# Altium schematic sheet TopLevel.SchDoc
size A; SheetNumber: 1
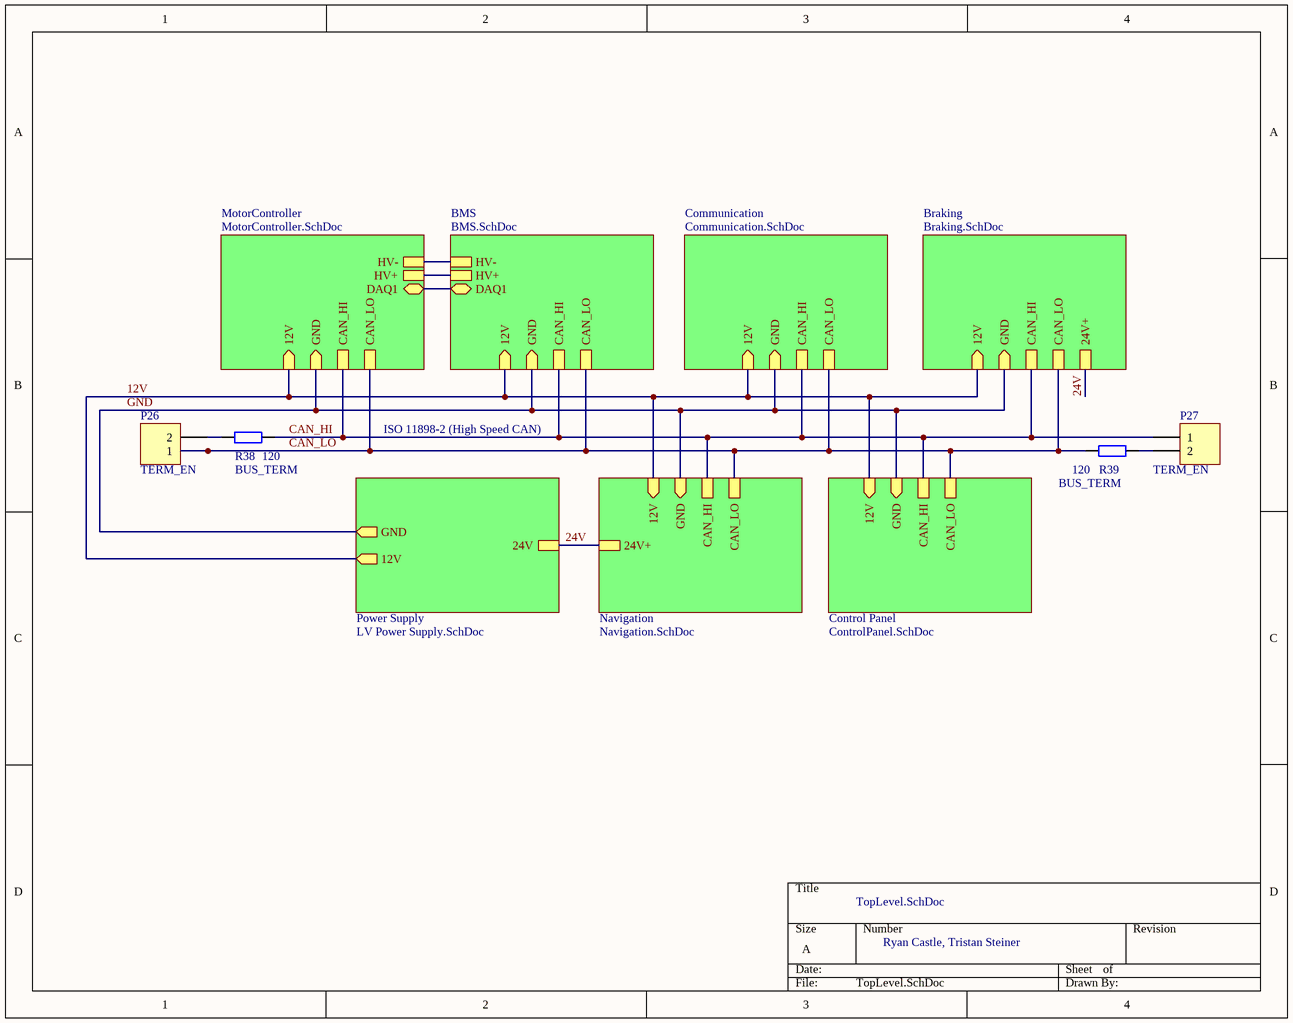
[diagram p0: TopLevel.SchDoc]

## Parts
P26  TERM_EN  [HDR1X2]
P27  TERM_EN  [HDR1X2]
R38  BUS_TERM  value 120  [AXIAL-0.4]
R39  BUS_TERM  value 120  [AXIAL-0.4]

## Sub-sheets
BMS = BMS.SchDoc: CAN_HI, CAN_LO, 12V (in), GND (in), HV-, HV+, DAQ1 (bidir)
Braking = Braking.SchDoc: CAN_HI, CAN_LO, 12V (in), GND (in), 24V+
Communication = Communication.SchDoc: CAN_HI, CAN_LO, 12V (in), GND (in)
Control Panel = ControlPanel.SchDoc: CAN_HI, CAN_LO, 12V (in), GND (in)
MotorController = MotorController.SchDoc: CAN_HI, CAN_LO, 12V (in), GND (in), HV+, HV-, DAQ1 (bidir)
Navigation = Navigation.SchDoc: CAN_HI, CAN_LO, 12V (in), GND (in), 24V+
Power Supply = LV Power Supply.SchDoc: 12V (out), GND (out), 24V

## Nets
12V: sheet BMS/12V, sheet Communication/12V, sheet Braking/12V, sheet Navigation/12V, sheet Control Panel/12V, sheet MotorController/12V, sheet Power Supply/12V
24V: sheet Braking/24V+, sheet Navigation/24V+, sheet Power Supply/24V
CAN_HI: P27.1 R38.2 ; sheet BMS/CAN_HI, sheet Communication/CAN_HI, sheet Braking/CAN_HI, sheet Navigation/CAN_HI, sheet Control Panel/CAN_HI, sheet MotorController/CAN_HI
CAN_LO: P26.1 R39.1 ; sheet BMS/CAN_LO, sheet Communication/CAN_LO, sheet Braking/CAN_LO, sheet Navigation/CAN_LO, sheet Control Panel/CAN_LO, sheet MotorController/CAN_LO
GND: sheet BMS/GND, sheet Communication/GND, sheet Braking/GND, sheet Navigation/GND, sheet Control Panel/GND, sheet MotorController/GND, sheet Power Supply/GND
NetP26_2: P26.2 R38.1
NetP27_2: P27.2 R39.2
(unnamed): sheet BMS/HV-, sheet MotorController/HV-
(unnamed): sheet BMS/HV+, sheet MotorController/HV+
(unnamed): sheet BMS/DAQ1, sheet MotorController/DAQ1

## Notes on the sheet
- ISO 11898-2 (High Speed CAN)
- TopLevel.SchDoc
- Ryan Castle, Tristan Steiner

## Library data of the parts
P26 P27 = Header 2: Header, 2-Pin; LatestRevisionDate: 17-Jul-2002; LatestRevisionNote: Re-released for DXP Platform.; Publisher: Altium Limited
R38 R39 = Res2: Resistor; Published: 8-Jun-2000; LatestRevisionDate: 17-Jul-2002; LatestRevisionNote: Re-released for DXP Platform.; PackageReference: AXIAL-0.4; Publisher: Altium Limited; PackageDescription: Axial Device, Thru-Hole; 2 Leads; 0.4 in Pin Spacing